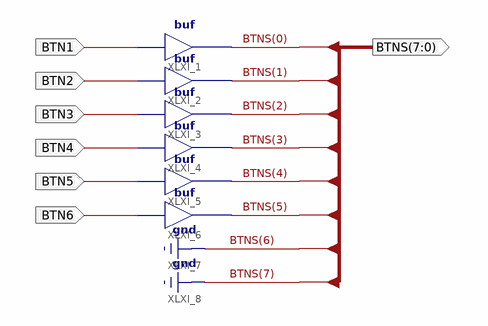
[diagram p0: schematic sheet 1]
// Xilinx ISE schematic BTN_inputs.sch (spartan6) as structural Verilog: 6 symbols, 7 ports
module BTN_inputs (
  input  BTN1,
  input  BTN2,
  input  BTN3,
  input  BTN4,
  input  BTN5,
  input  BTN6,
  output [7:0] BTNS
);

  buf XLXI_1 (BTNS[0], BTN1);
  buf XLXI_2 (BTNS[1], BTN2);
  buf XLXI_3 (BTNS[2], BTN3);
  buf XLXI_4 (BTNS[3], BTN4);
  buf XLXI_5 (BTNS[4], BTN5);
  buf XLXI_6 (BTNS[5], BTN6);

  assign BTNS[7:6] = 2'b00;
endmodule
